# Altium project master-010106.PrjPcb (part 5 of 5)

## Sheet memorycard.SchDoc: foxBMS BMS-Extension
size A3; DocumentNumber: 10; SheetNumber: 10; SheetTotal: 14; Author: Fraunhofer IISB foxBMS Team; REL-DATE: 2017-05-16; VERSION: 1.0.2; GateName_1: G$1; SymbolName_1: FRAME_B_L; LibraryName: foxBMS_BMS-Master_V1.00_A; DeviceSetName: FRAME_B_L; GateName_2: G$2; SymbolName_2: DOCFIELD; SheetDescription: Memorycard
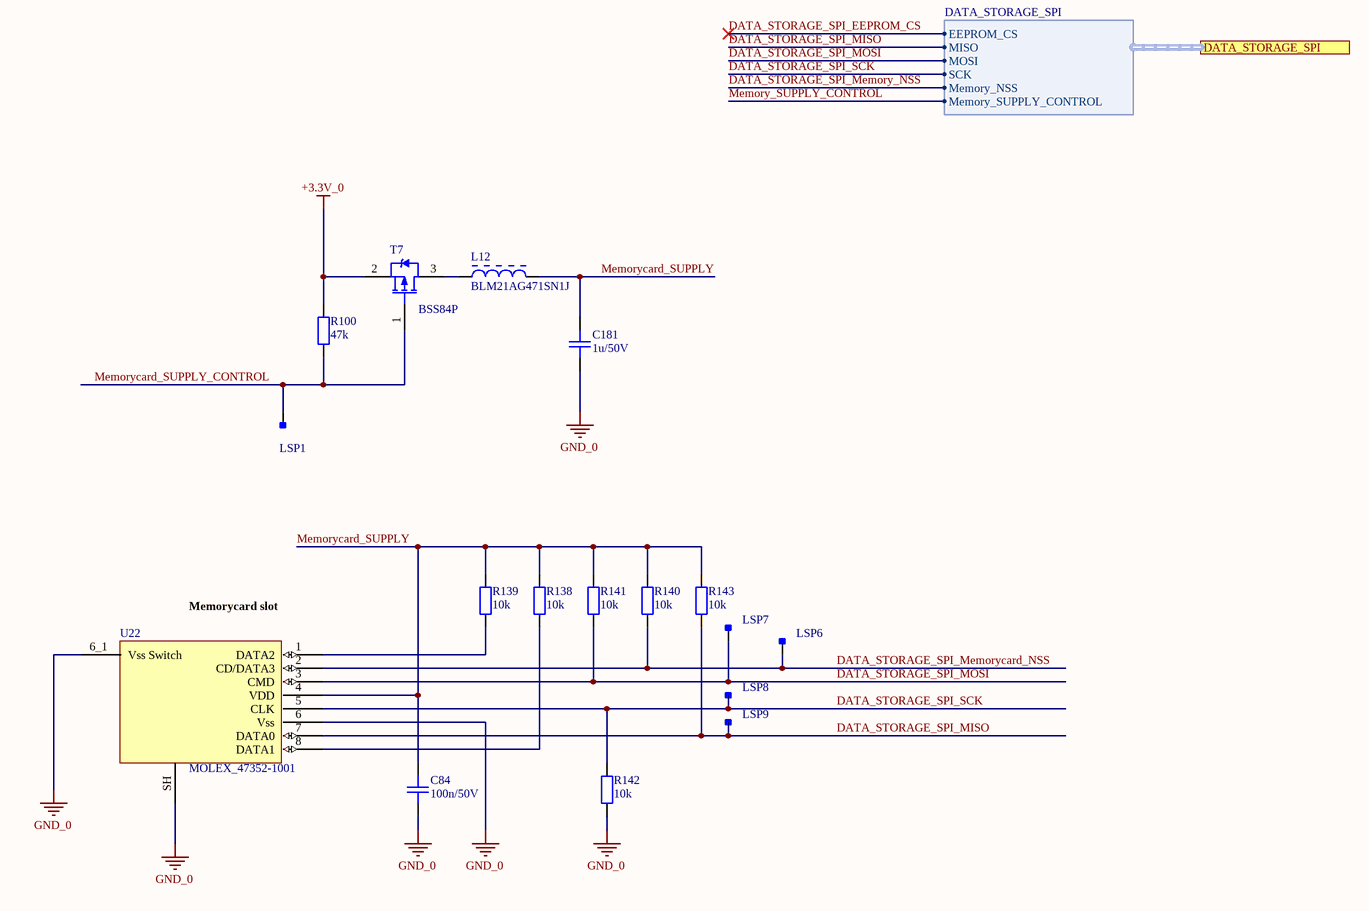
[diagram p25: memorycard.SchDoc]

### Parts
(Parts that share a designator on the sheet are numbered #1, #2 ... from top to bottom, then left to right.)
C84#2  100n/50V  [0603C]
C181  1u/50V  [0603C]
L12  BLM21AG471SN1J  [MURA-BLM21-H1-CHIP-2_V]
LSP1  Testpoint_Square  [Testpoint_S1]  (value not drawn)  (no BOM)
LSP6  Testpoint_Square  [Testpoint_S1]  (value not drawn)  (no BOM)
LSP7  Testpoint_Square  [Testpoint_S1]  (value not drawn)  (no BOM)
LSP8  Testpoint_Square  [Testpoint_S1]  (value not drawn)  (no BOM)
LSP9  Testpoint_Square  [Testpoint_S1]  (value not drawn)  (no BOM)
R100#2  47k  [0603R]
R138  10k  [0603R]
R139  10k  [0603R]
R140  10k  [0603R]
R141  10k  [0603R]
R142  10k  [0603R]
R143  10k  [0603R]
T7#2  BSS84P  [INF-PG-SOT23_N]
U22  MOLEX_47352-1001  [MOLEX_47352_1001]

### Ports
DATA_STORAGE_SPI (harness DATA_STORAGE_SPI)

### Harnesses
DATA_STORAGE_SPI: EEPROM_CS, MISO, MOSI, SCK, Memory_NSS, Memory_SUPPLY_CONTROL

### Nets
+3.3V_0: R100#2.2 T7#2.2(SOURCE)
GND_0: C84#2.1 C181.2 R142.1 U22.6(Vss) U22.6_1(Vss_Switch) U22.SH  [project net GND]
DATA_STORAGE_SPI_Memorycard_NSS: LSP6.1 R140.1 U22.2(CD/DATA3)
DATA_STORAGE_SPI_MISO: LSP9.1 R143.1 U22.7(DATA0) ; port DATA_STORAGE_SPI.MISO
DATA_STORAGE_SPI_MOSI: LSP7.1 R141.1 U22.3(CMD) ; port DATA_STORAGE_SPI.MOSI
DATA_STORAGE_SPI_SCK: LSP8.1 R142.2 U22.5(CLK) ; port DATA_STORAGE_SPI.SCK
Memorycard_SUPPLY: C84#2.2 C181.1 L12.1 R138.2 R139.2 R140.2 R141.2 R143.2 U22.4(VDD)
Memorycard_SUPPLY_CONTROL: LSP1.1 R100#2.1 T7#2.1(GATE)
NetL12_2: L12.2 T7#2.3(DRAIN)
NetR138_1: R138.1 U22.8(DATA1)
NetR139_1: R139.1 U22.1(DATA2)

### Notes on the sheet
- (near U22) Memorycard slot
- Fraunhofer IISB
- Schottkystr. 10
- developed by:
- 91058 Erlangen
- Germany
- Author
- Project
- License
- Description
- File
- Version
- Release Date
- Sheet
- www.foxbms.org
- www.iisb.fraunhofer.de
- foxBMS Team
- /

### Library data of the parts
C84#2 = gen_C_ceramic_100n_50V_X7R_0603: MLCC; Capacitance: 100n; Rated Voltage: 50V; Dielectric: X7R; Case EIA: 0603; Case Metric: 1608; PnP Package: C_0603_10; PnP Value: 100n/50V/X7R; PnP equipped: x; Part Number: gen_C_ceramic_100n_50V_X7R_0603; Supplier 1: Farnell; Supplier Part Number 1: 2525267
C181 = gen_C_ceramic_1u_50V_X7R_0603: MLCC; Capacitance: 1u; Rated Voltage: 50V; Dielectric: X7R; Tolerance: ± 10%; Case EIA: 0603; Case Metric: 1608; Part Number: gen_C_ceramic_1u_50V_X7R_0603; Operating Temperature: -55°C - +125°C; Supplier 1: Farnell; Supplier Part Number 1: 2779055
L12 = CMP-0686-00649-2: Chip Ferrite Bead for General Signal lines, 470 Ohm, 700 mA, -55 to 125 degC, 2 x 1.25 x 1.05 mm SMD, Tape and Reel; Manufacturer: Murata; DC Resistance: 0.19 Ohm Max.; Impedance (at 100 MHz): 470 Ohm +/- 25%; Rated Current: 700 mA; ComponentLink1URL: http://www.murata.com/; Packing: Tape and Reel; PackageDescription: 2-Pin Chip, Body 2 x 1.25 mm; ComponentLink3Description: Package Specification; Operating Temperature Range: -55 to 125 degC; ComponentLink1Description: Manufacturer URL; PartNumber: BLM21AG471SN1J; DatasheetVersion: 08/2013; Mounting Technology: Surface Mount; ComponentLink2URL: http://www.murata.com/products/catalog/pdf/c31e.pdf; ComponentLink3URL: http://www.murata.com/products/catalog/pdf/c31e.pdf; ComponentLink2Description: Datasheet; PackageReference: BLM21_H1050-2
LSP1 LSP6-LSP9 = Testpoint_Square: Testpoint, square; Part Number: Testpoint_Square
R100#2 = gen_R_47k_0603: SMD Resistor 47k 0603; Tolerance: 1%; Power: 0.1W; Case EIA: 0603; Case Metric: 1608; Maximum Working Voltage: 75V; PnP Package: R_0603; Part Number: gen_R_47k_0603; Operating Temperature: -55°C - +155°C; Resistance: 47k; Series: E24; PnP Value: 47k; Supplier 1: Farnell; Supplier Part Number 1: 2073510
R138-R143 = gen_R_10k_0603: SMD Resistor 10k 0603; Tolerance: 1%; Power: 0.1W; Case EIA: 0603; Case Metric: 1608; Maximum Working Voltage: 75V; PnP Package: R_0603; Part Number: gen_R_10k_0603; Operating Temperature: -55°C - +155°C; Resistance: 10k; Series: E24, E96; PnP Value: 10k; Supplier 1: Farnell; Supplier Part Number 1: 2073349
T7#2 = CMP-1099-00028-1: P-Channel SIPMOS Small-Signal-Transistor, -60 V VDS, -0.17 A ID, -55 to 150 degC, PG-SOT23, Reel, Green; Manufacturer: Infineon; VGS(th) (max): -2Â V; VGS(th) (min): -1Â V; VDS (max): -60Â V; Rth: 350Â K/W; Pto t (max): 0.36Â W; ID (max): -0.17Â A; IDpuls (max): -0.68Â A; RDS (on) (max) (@4.5V): 12,000Â mOhm; QG: 1Â nC; Green: TRUE; RDS (on) (max): 8,000Â mOhm; ComponentLink3URL: http://www.infineon.com/dgdl/SOT23-Package_Overview.pdf?folderId=db3a30431936bc4b0119532290053c66&fileId=db3a30431936bc4b0119533468123c85; ComponentLink3Description: Package Specification; Packing: Reel; PartNumber: BSS84P; ComponentLink2Description: Datasheet; Mounting Technology: Surface Mount; ComponentLink2URL: http://www.infineon.com/dgdl/BSS84P_Rev2.7%5B1%5D.pdf?folderId=db3a304314dca38901154a72e3951a65&fileId=db3a304330f68606013118ac7a9b4549; PackageReference: PG-SOT23; ComponentLink1URL: http://www.infineon.com/; PackageVersion: Apr-08; ComponentLink1Description: Manufacturer URL; PackageDescription: 3-Pin Small Outline Transistor Package, 2.9 x 1.3 mm Body, 0.95 mm Pitch; Halogen-free: TRUE; DatasheetVersion: Rev. 2.7
U22 = molex_47352-1001: 1.10mm Pitch Memorycard Card Connector, Push-Push Type, with VSS (Supply Voltage Ground) Detect Switch, Lead-Free; Manufacturer: Molex; Circuits: 10; Rated Voltage: 100V DC; Rated Current: 0.5A; Automotive Qualified: False; Part Number: molex_47352-1001; Part Name: 47352-1001; Operating Temperature: -20°C - +85°C; ComponentLink1Description: Drawing; ComponentLink1URL: http://www.molex.com/pdm_docs/sd/473521001_sd.pdf; Supplier 1: Farnell; Supplier Part Number 1: 2424133

## Sheet CAN_new.SchDoc: foxBMS BMS-Master
size A3; DocumentNumber: 14; SheetNumber: 14; SheetTotal: 24; Author: Fraunhofer IISB foxBMS Team; REL-DATE: 2017-05-16; VERSION: 1.0.6; SheetDescription: CAN0 Interface for MCU0; Rule: UNIONINDEX=0|RULEKIND=Clearance|NETSCOPE=DifferentNets|LAYERKIND=SameLayer|NAME=Schematic Clearance Constraint|GAP=10mil|GENERICCLEARANCE=10mil|IGNOREPADTOPADCLEARANCEINFOOTPRINT=FALSE|OBJECTCLEARANCES=ClearanceObj_Arc-ClearanceObj_Hole:0;ClearanceObj_Track-ClearanceObj_Hole:0;ClearanceObj_SMDPad-ClearanceObj_Hole:0;ClearanceObj_THPad-ClearanceObj_Hole:0;ClearanceObj_Via-ClearanceObj_Hole:0;ClearanceObj_Fill-ClearanceObj_Hole:0;ClearanceObj_Poly-ClearanceObj_Hole:0;ClearanceObj_Region-ClearanceObj_Hole:0;ClearanceObj_Text-ClearanceObj_Hole:0|UNIT=Metric
Used 2 times, as channels U_08_CAN1, U_08_CAN0. Parts and nets are listed once, with the designators drawn on the sheet.
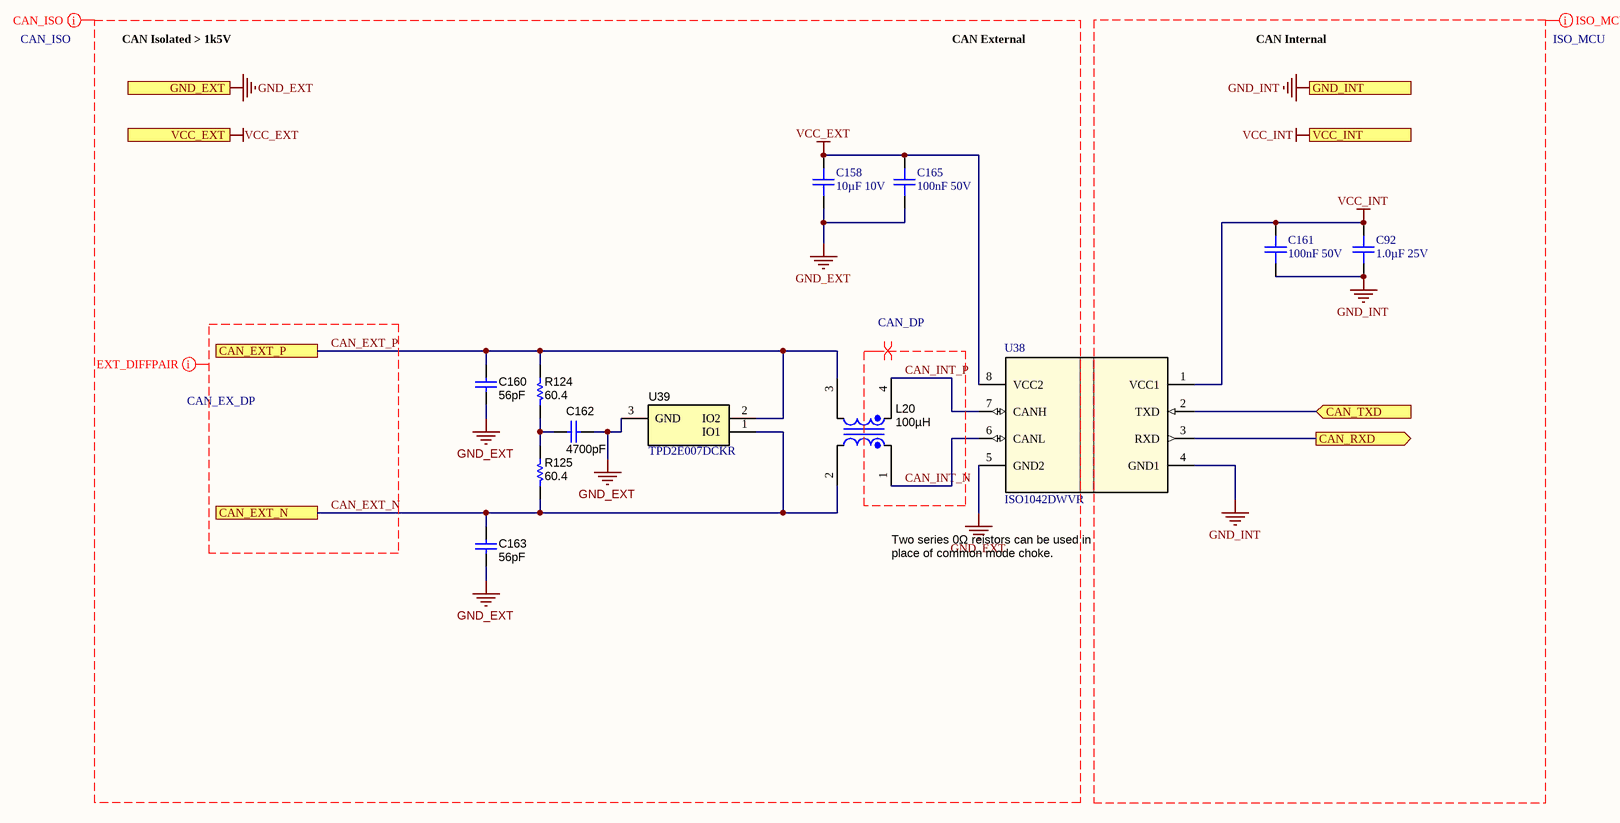
[diagram p26: CAN_new.SchDoc]

### Parts
C92  1.0µF 25V  [0603C]
C158  10µF 10V  [0805C]
C160  ValueDisplayed: 56pF  [0603C]  (hidden comment: GRM1885C1H560JA01D)
C161  100nF 50V  [0603C]
C162  ValueDisplayed: 4700pF  [0603C]  (hidden comment: GCM188R71H472KA37D)
C163  ValueDisplayed: 56pF  [0603C]  (hidden comment: GRM1885C1H560JA01D)
C165  100nF 50V  [0603C]
L20  ValueDisplayed: 100µH  [SIMDAD_1812]  (hidden comment: B82789C0104H001)
R124  ValueDisplayed: 60.4  [1206R]  (hidden comment: CRCW120660R4FKEA)
R125  ValueDisplayed: 60.4  [1206R]  (hidden comment: CRCW120660R4FKEA)
U38  ISO1042DWVR  [DWV0008A]
U39  TPD2E007DCKR  [DCK0003A_N]

### Ports
CAN_EXT_N, CAN_EXT_P, CAN_RXD (out), CAN_TXD (in), GND_EXT, GND_INT, VCC_EXT, VCC_INT

### Nets
GND_EXT: C158.2 C160.2 C162.2 C163.2 C165.1 U38.5(GND2) U39.3(GND) ; port GND_EXT
GND_INT: C92.1 C161.1 U38.4(GND1) ; port GND_INT
VCC_EXT: C158.1 C165.2 U38.8(VCC2) ; port VCC_EXT
VCC_INT: C92.2 C161.2 U38.1(VCC1) ; port VCC_INT
CAN_EXT_N: C163.1 L20.2 R125.1 U39.1(IO1) ; port CAN_EXT_N
CAN_EXT_P: C160.1 L20.3 R124.2 U39.2(IO2) ; port CAN_EXT_P
CAN_INT_N: L20.1 U38.6(CANL)
CAN_INT_P: L20.4 U38.7(CANH)
CAN_RXD: U38.3(RXD) ; port CAN_RXD
CAN_TXD: U38.2(TXD) ; port CAN_TXD
NetC162_1: C162.1 R124.1 R125.2

### Channels
U_08_CAN1: designators end in _1; ports CAN_EXT_N=CAN_EXT_N_U_08_CAN1 CAN_EXT_P=CAN_EXT_P_U_08_CAN1 CAN_RXD=CAN_1_RX CAN_TXD=CAN_1_TX GND_EXT=GND GND_INT=GND VCC_EXT=+3.3V_COM VCC_INT=+3.3V_0
U_08_CAN0: designators end in _2; ports CAN_EXT_N=CAN_EXT_N_U_08_CAN0 CAN_EXT_P=CAN_EXT_P_U_08_CAN0 CAN_RXD=CAN_0_RX CAN_TXD=CAN_0_TX GND_EXT=GND GND_INT=GND VCC_EXT=+3.3V_COM VCC_INT=+3.3V_0

### Layout directives
net class CAN_ISO: CAN_EXT_N, CAN_EXT_P, CAN_INT_N, CAN_INT_P, GND_EXT, VCC_EXT
net class ISO_MCU: GND_INT, VCC_INT
differential pair; differential pair class CAN_DP: CAN_INT_N, CAN_INT_P
differential pair; differential pair class CAN_EX_DP: CAN_EXT_N, CAN_EXT_P

### Notes on the sheet
- CAN Isolated > 1k5V
- CAN External
- CAN Internal
- Two series 0Ω reistors can be used in
- place of common mode choke.
- Fraunhofer IISB
- Schottkystr. 10
- developed by:
- 91058 Erlangen
- Germany
- Author
- Project
- License
- Description
- File
- Version
- Release Date
- Sheet
- www.foxbms.org
- www.iisb.fraunhofer.de
- foxBMS Team
- /

### Library data of the parts
C92 = gen_C_ceramic_1u_25V_X7R_0603: Ceramic, 1.0µF, ±10%, 25V, X7R, –55 to 125°C, 0603 (1608),RoHS, Automotive; Part Number: GCJ188R71E105KA01; Manufacturer: Murata; Capacitance: 1µF; Case EIA: 0603; Case Metric: 1608; PnP Package: C_0603_10; PnP Value: 1.0µF/25V/X7R; Automotive Qualified: True; Rated Voltage: 25V; Dielectric: X7R; Supplier 1: Digi-Key; Supplier Part Number 1: 490-14409-1-ND; Height - Seated (Max): 0.8mm; Mounting Type: SurfaceMount,MLCC; Operating Temperature: –55 to 125°C; Series: GCJ; Tolerance: ±10%; Manufacturer_Part_Number: GCJ188R71E105KA01
C158 = gen_C_ceramic_10u_10V_X7R_0805: Ceramic, 10µF, ±10%, 10V, X7R, –55 to 125°C, 0805 (2012),RoHS, Automotive; Part Number: GCJ21BR71A106KE01; Manufacturer: Murata; Case EIA: 0805; Case Metric: 2012; Automotive Qualified: True; PnP Package: C_0805_10; PnP Value: 10µF/10V/X7R; Capacitance: 10µF; Rated Voltage: 10V; Dielectric: X7R; Supplier 1: Digi-Key; Supplier Part Number 1: 490-12646-1-ND; Height - Seated (Max): 1.25mm; Mounting Type: SurfaceMount,MLCC; Operating Temperature: –55 to 125°C; Series: GCJ; Tolerance: ±10%; Manufacturer_Part_Number: GCJ21BR71A106KE01
C160 C163 = GRM1885C1H560JA01D: CAP, CERM, 56 pF, 50 V, +/- 5%, C0G/NP0, 0603; Manufacturer: MuRata; Polarized: N; CompType: Capacitor; Value: 56pF; U/M: EA; Cap_F: 0.000000000056; Tolerance_%: 5; Value1: Unknown; VDC_V: 50; Value2: 50V; TaMin_C: -55; TaMax_C: 125; Cap_Case: 0603; SizeArea_mm2: 1.28; SizeAreaWB_mm2: 4.68; SizeX_mm: 1.6; SizeY_mm: 0.8; SizeZ_mm: 1; AEC Category: Q200; SymbolVersion: 2008-07-09; PartNumber: GRM1885C1H560JA01D; PackageReference: 0603; RoHS: Y; MountType: SMT; Technology: Ceramic; TempCo: C0G/NP0; Published: 2008-06-19; Publisher: Texas Instruments; LatestRevisionDate: 2017-03-07; ComponentLink1Description: Datasheet link; ComponentLink1URL: http://search.murata.co.jp/Ceramy/PnsearchViewAction.do?HnOFG=ON&HnNFG=ON&SEL_CNT=50&sLang=en&sKey=GRM1885C1H560JA01D&x=9&y=9&search=startwith; Supplier 1: Digi-Key; Supplier Part Number 1: 490-1421-1-ND; Supplier 2: Mouser; Supplier Part Number 2: 81-GRM39C560J50; Supplier 3: Farnell; Supplier Part Number 3: 1828911; AEC Qualified: ?
C161 C165 = gen_C_ceramic_100n_50V_X7R_0603: Ceramic, 100nF, ±10%, 50V, X7R, –55 to 125°C, 0603 (1608),RoHS, Automotive; Part Number: GCJ188R71H104KA12; Manufacturer: Murata; Capacitance: 100n; Case EIA: 0603; Case Metric: 1608; PnP Package: C_0603_10; PnP Value: 100nF/50V/X7R; PnP equipped: x; Automotive Qualified: True; Rated Voltage: 50V; Dielectric: X7R; Supplier 1: Digi-Key; Supplier Part Number 1: 490-5798-1-ND; Height - Seated (Max): 0.8mm; Mounting Type: SurfaceMount,MLCC; Operating Temperature: –55 to 125°C; Series: GCJ; Tolerance: ±10%; Manufacturer_Part_Number: GCJ188R71H104KA12
C162 = GCM188R71H472KA37D: CAP, CERM, 4700 pF, 50 V, +/- 10%, X7R, AEC-Q200 Grade 1, 0603; Manufacturer: MuRata; Polarized: N; CompType: Capacitor; Value: 4700pF; U/M: EA; Cap_F: 0.0000000047; Tolerance_%: 10; Value1: Unknown; VDC_V: 50; Value2: 50V; TaMin_C: -55; TaMax_C: 125; Cap_Case: 0603; SizeArea_mm2: 1.28; SizeAreaWB_mm2: 4.68; SizeX_mm: 1.6; SizeY_mm: 0.8; SizeZ_mm: 1; AEC Category: Q200; AEC Qualified: Y; SymbolVersion: 2008-07-09; PartNumber: GCM188R71H472KA37D; PackageReference: 0603; RoHS: Y; MountType: SMT; Technology: Ceramic; TempCo: X7R; Published: 2008-06-19; Publisher: Texas Instruments; LatestRevisionDate: 2017-03-07; ComponentLink1Description: Datasheet link; ComponentLink1URL: http://psearch.murata.com/capacitor/product/GCM188R71H472KA37%23.pdf; Supplier 1: Digi-Key; Supplier Part Number 1: 490-4932-1-ND; Supplier 2: Mouser; Supplier Part Number 2: 81-GCM188R71H472K37D; AEC Grade: 1
L20 = B82789C0104H001: Coupled inductor, 100 µH, 0.15 A, 1.5 ohm, SMD; Manufacturer: TDK; SymbolCreator: a0412235; Value: 100uH; Ind_H: 100.0E-6; DCR_ohm: 1.5; SymbolVersion: 2013-02-26; PartNumber: B82789C0104H001; PackageReference: 4.5x3.0x3.2mm; MountType: SMT; ComponentLink1URL: http://www.epcos.com/inf/30/db/ind_2008/b82789c0_s0.pdf; ComponentLink1Description: Datasheet URL; RoHS: Y; CompType: Coupled Inductor; Publisher: Texas Instruments; Published: 2008-05-16; LatestRevisionDate: 2017-02-16; Supplier 1: Mouser; Supplier Part Number 1: 871-B82789C0104H001
R124 R125 = CRCW120660R4FKEA: RES, 60.4, 1%, 0.25 W, 1206; Manufacturer: Vishay-Dale; CompType: Resistor; Value: 60.4; Value_Code: 60R4; Tolerance_%: 1; Power_W: 0.25; Value2: 0.25W; VDC_V: 200; TempCo: 100 ppm/C; SizeArea_mm2: 5.12; SizeX_mm: 3.2; SizeY_mm: 1.6; SizeZ_mm: 1.35; EIA_Code: E96; U/M: EA; AEC Category: Q200; SymbolVersion: 2009-05-29; PartNumber: CRCW120660R4FKEA; PackageReference: 1206; RoHS: Y; Res_ohm: 60.4; Value1: 1%; MountType: SMT; Technology: Thick Film; Published: 2008-06-26; Publisher: Texas Instruments; LatestRevisionDate: 2017-03-07; ComponentLink1Description: Datasheet link; ComponentLink1URL: http://www.vishay.com/docs/20035/dcrcwe3.pdf; Supplier 1: Digi-Key; Supplier Part Number 1: 541-60.4FCT-ND; Supplier 2: Newark; Supplier Part Number 2: 53K2546; Supplier 3: Mouser; Supplier Part Number 3: 71-CRCW1206-60.4-E3; AEC Qualified: ?
U38 = ISO1042DWVR: Imported; Manufacturer: Texas Instruments; PartNumber: ISO1042DWVR; RefDes: RefDes; TYPE: TYPE; Value: Value
U39 = TPD2E007DCKR: ESD Protection Array for AC Signal Data Interface, 2 Channels, -40 to +85 degC, 3-pin SC70 (DCK), Green (RoHS & no Sb/Br); Manufacturer: Texas Instruments; Alternate PartNumber: Equivalent; Breakdown Voltage(Min)(V): +/-14; IEC 61000-4-2 Air-Gap(+/- kV): 15; IEC 61000-4-2 Contact(+/- kV): 8; IO Leakage Current(nA): 50; SubFamily: ESD Solution; DatasheetVersion: SLVS796E; PackageVersion: revG, Jan-2007; PackageReference: DCK0003A; PackageDescription: 3-Pin Plastic Small-Outline Package, 0.65 mm Pitch, 2.1 mm Lead Span; Supplier 1: Digi-Key; Supplier Part Number 1: 296-25281-2-ND; Supplier 2: Digi-Key; Supplier Part Number 2: 296-25281-1-ND; Supplier 3: Digi-Key; Supplier Part Number 3: 296-25281-6-ND; Supplier 4: Farnell; Supplier Part Number 4: 2120465; Supplier 5: Newark; Supplier Part Number 5: 94T5089; Supplier 6: Newark; Supplier Part Number 6: 55R7554; Supplier 7: Mouser; Supplier Part Number 7: 595-TPD2E007DCKR; Eco-Plan: Green (RoHS & no Sb/Br); IO Capacitance(Typ)(pF): 15; MountType: SMT; PartNumber: TPD2E007DCKR; ComponentLink1Description: Datasheet; ComponentLink1URL: http://www.ti.com/general/docs/lit/getliterature.tsp?genericPartNumber=TPD2E007&fileType=pdf; ComponentLink2Description: URL Link1; ComponentLink2URL: SamplesURL:http://www.ti.com/product/tpd2e007#samples; Alternate Manufacturer: Texas Instruments

## Sheet isolated_usb_single.SchDoc
size A4 portrait
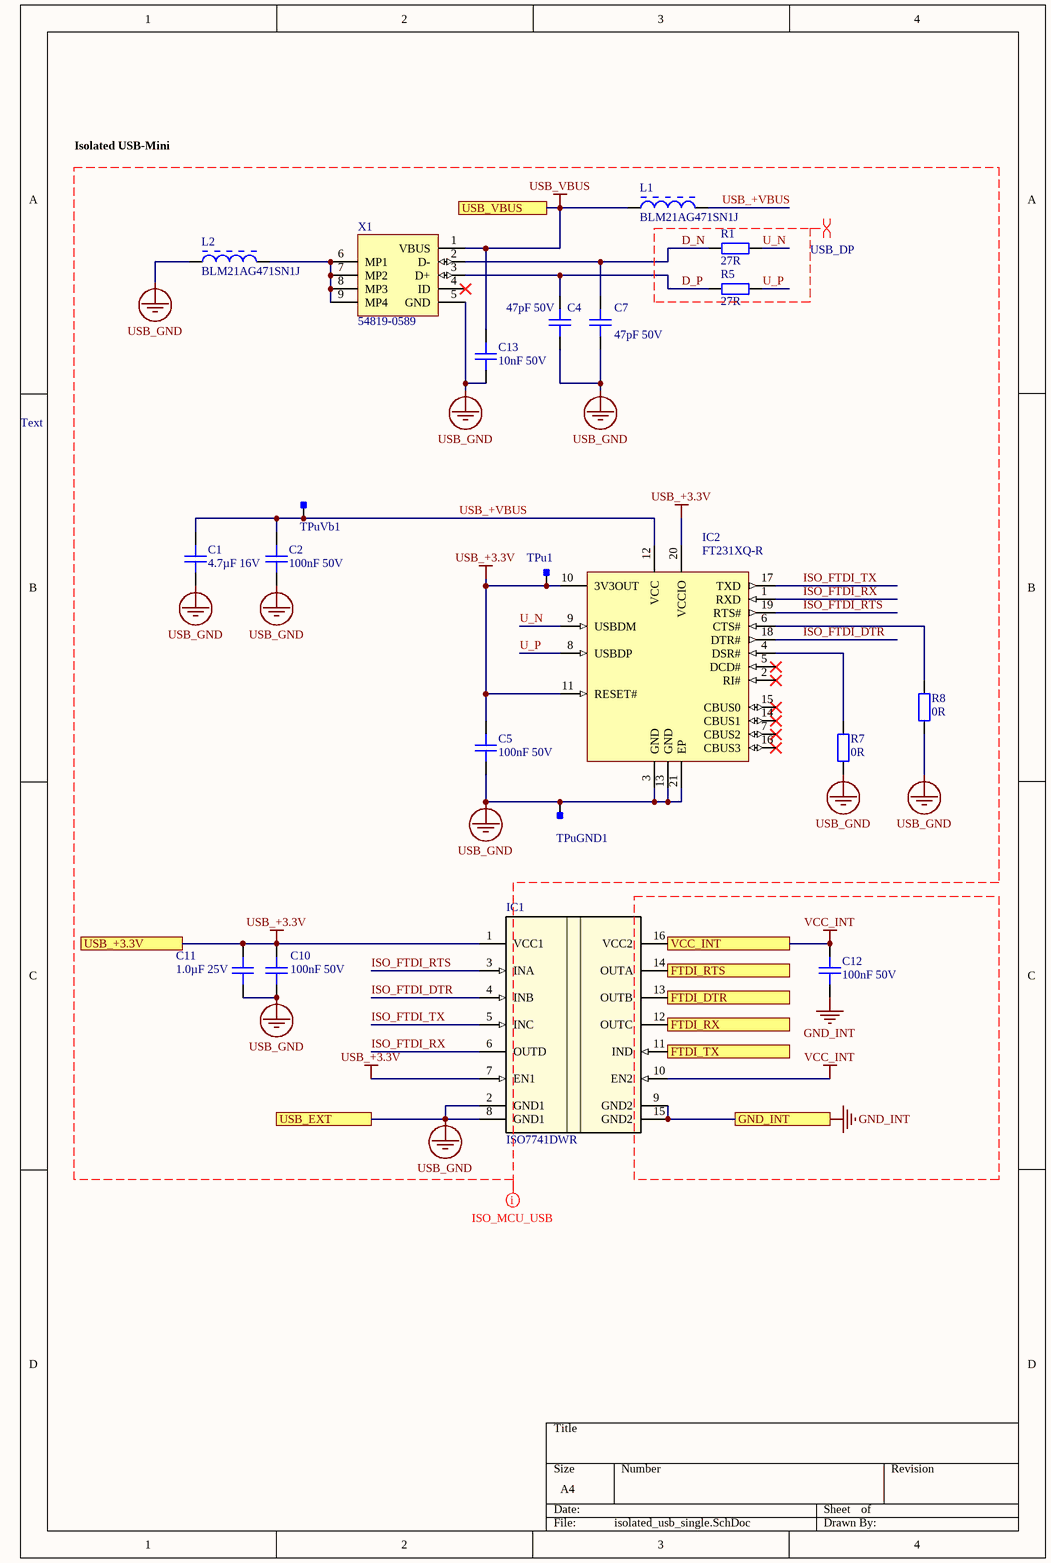
[diagram p27: isolated_usb_single.SchDoc]

### Parts
(Parts that share a designator on the sheet are numbered #1, #2 ... from top to bottom, then left to right.)
C1  4.7µF 16V  [0805C]
C2#2  100nF 50V  [0603C]
C4  47pF 50V  [0402C]
C5  100nF 50V  [0603C]
C7  47pF 50V  [0402C]
C10  100nF 50V  [0603C]
C11#2  1.0µF 25V  [0603C]
C12#2  100nF 50V  [0603C]
C13  10nF 50V  [0603C]
IC1  ISO7741DWR  [DW0016B_N]
IC2  FT231XQ-R  [QFN-20_N]
L1  BLM21AG471SN1J  [MURA-BLM21-H1-CHIP-2_V]
L2  BLM21AG471SN1J  [MURA-BLM21-H1-CHIP-2_V]
R1#2  27R  [0603R]
R5#2  27R  [0603R]
R7  0R  [0603R]
R8  0R  [0603R]
TPu1  Testpoint_Square  [Testpoint_S1]  (value not drawn)  (no BOM)
TPuGND1  Testpoint_Square  [Testpoint_S1]  (value not drawn)  (no BOM)
TPuVb1  Testpoint_Square  [Testpoint_S1]  (value not drawn)  (no BOM)
X1  54819-0589  [54819-0589]

### Ports
FTDI_DTR (out), FTDI_RTS (out), FTDI_RX (out), FTDI_TX (in), GND_INT, USB_+3.3V, USB_EXT, USB_VBUS, VCC_INT

### Nets
GND_INT: C12#2.2 IC1.9(GND2) IC1.15(GND2) ; port GND_INT  [project net GND]
USB_+3.3V: C5.1 C10.1 C11#2.2 IC1.1(VCC1) IC1.7(EN1) IC2.10(3V3OUT) IC2.11(RESET#) IC2.20(VCCIO) TPu1.1 ; port USB_+3.3V
USB_GND: C1.2 C2#2.2 C4.1 C5.2 C7.1 C10.2 C11#2.1 C13.2 IC1.2(GND1) IC1.8(GND1) IC2.3(GND) IC2.13(GND) IC2.21(EP) L2.1 R7.2 R8.2 TPuGND1.1 X1.5(GND) ; port USB_EXT
USB_VBUS: C13.1 L1.1 X1.1(VBUS) ; port USB_VBUS
VCC_INT: C12#2.1 IC1.10(EN2) IC1.16(VCC2) ; port VCC_INT  [project net +3.3V_0]
D_N: C7.2 R1#2.1 X1.2(D-)
D_P: C4.2 R5#2.1 X1.3(D+)
ISO_FTDI_DTR: IC1.4(INB) IC2.18(DTR#)
ISO_FTDI_RTS: IC1.3(INA) IC2.19(RTS#)
ISO_FTDI_RX: IC1.6(OUTD) IC2.1(RXD)
ISO_FTDI_TX: IC1.5(INC) IC2.17(TXD)
U_N: IC2.9(USBDM) R1#2.2
U_P: IC2.8(USBDP) R5#2.2
USB_+VBUS: C1.1 C2#2.1 IC2.12(VCC) L1.2 TPuVb1.1
NetIC1_11: IC1.11(IND) ; port FTDI_TX
NetIC1_12: IC1.12(OUTC) ; port FTDI_RX
NetIC1_13: IC1.13(OUTB) ; port FTDI_DTR
NetIC1_14: IC1.14(OUTA) ; port FTDI_RTS
NetIC2_4: IC2.4(DSR#) R7.1
NetIC2_6: IC2.6(CTS#) R8.1
NetL2_2: L2.2 X1.6(MP1) X1.7(MP2) X1.8(MP3) X1.9(MP4)

Not connected (* = marked no-connect by the designer): IC2 2(RI#)* 5(DCD#)* 7(CBUS2)* 14(CBUS1)* 15(CBUS0)* 16(CBUS3)*; X1 4(ID)*

### Layout directives
net class ISO_MCU_USB: D_N, D_P, ISO_FTDI_DTR, ISO_FTDI_RTS, ISO_FTDI_RX, ISO_FTDI_TX, U_N, U_P, USB_+3.3V, USB_+VBUS, USB_GND, USB_VBUS
differential pair; differential pair class USB_DP: D_N, D_P, U_N, U_P

### Notes on the sheet
- Isolated USB-Mini
- Text

### Library data of the parts
C1 = gen_C_ceramic_4u7_16V_X7R_0805: Ceramic, 4.7µF, ±10%, 16V, X7R, –55 to 125°C, 0805 (2012),RoHS, Automotive; Part Number: GCJ21BR71C475KA01; Manufacturer: Murata; Capacitance: 4u7; Case EIA: 0805; Case Metric: 2012; AVT Set: x; Automotive Qualified: True; PnP Package: C_0805_10; PnP Value: 4.7µF/16V/X7R; Rated Voltage: 16V; Dielectric: X7R; Supplier 1: Digi-Key; Supplier Part Number 1: 490-10557-1-ND; Height - Seated (Max): 1.25mm; Mounting Type: SurfaceMount,MLCC; Operating Temperature: –55 to 125°C; Series: GCJ; Tolerance: ±10%; Manufacturer_Part_Number: GCJ21BR71C475KA01
C2#2 C5 C10 C12#2 = gen_C_ceramic_100n_50V_X7R_0603: as C161 on sheet CAN_new; Rated Voltage: 50V; Dielectric: X7R; Supplier 1: Digi-Key; Supplier Part Number 1: 490-5798-1-ND; Height - Seated (Max): 0.8mm; Mounting Type: SurfaceMount,MLCC; Operating Temperature: –55 to 125°C; Series: GCJ; Tolerance: ±10%; Manufacturer_Part_Number: GCJ188R71H104KA12
C4 C7 = gen_C_ceramic_47p_50V_C0G_0402: Ceramic, 47pF, ±5%, 50V, C0G, 25 to 125°C, 0402 (1005),RoHS, Automotive; Part Number: GCM1555C1H470JA16#; Manufacturer: Murata; Capacitance: 47; Case EIA: 0402; Case Metric: 1005; Automotive Qualified: True; PnP Package: C_0402_10; PnP Value: 47pF/50V/X7R; Rated Voltage: 50V; Dielectric: C0G; Supplier 1: Digi-Key; Supplier Part Number 1: 490-10670-1-ND; Height - Seated (Max): 0.5mm; Mounting Type: SurfaceMount,MLCC; Operating Temperature: -55 to 125°C; Series: GCM; Tolerance: ±5%; Manufacturer_Part_Number: GCM1555C1H470JA16#
C11#2 = gen_C_ceramic_1u_25V_X7R_0603: Ceramic, 1.0µF, ±10%, 25V, X7R, –55 to 125°C, 0603 (1608),RoHS, Automotive; Part Number: GCJ188R71E105KA01; Manufacturer: Murata; Case EIA: 0603; Case Metric: 1608; Capacitance: 1µF; Automotive Qualified: True; PnP Package: C_0603_10; PnP Value: 1.0µF/25V/X7R; Dielectric: X7R; Rated Voltage: 25V; Height - Seated (Max): 0.8mm; Mounting Type: SurfaceMount,MLCC; Operating Temperature: –55 to 125°C; Series: GCJ; Tolerance: ±10%; Manufacturer_Part_Number: GCJ188R71E105KA01; Supplier 1: Digi-Key; Supplier Part Number 1: 490-14409-1-ND
C13 = gen_C_ceramic_10n_50V_X7R_0603: Ceramic, 10nF, ±10%, 50V, X7R, –55 to 125°C, 0603 (1608),RoHS, Automotive; Part Number: GCJ188R71H102KA01; Manufacturer: Murata; Capacitance: 10n; Case EIA: 0603; Case Metric: 1608; PnP Package: C_0603_10; PnP Value: 10nF/50V/X7R; Automotive Qualified: True; Rated Voltage: 50V; Dielectric: X7R; Supplier 1: Digi-Key; Supplier Part Number 1: 490-5768-1-ND; Height - Seated (Max): 0.8mm; Mounting Type: SurfaceMount,MLCC; Operating Temperature: –55 to 125°C; Series: GCJ; Tolerance: ±10%; Manufacturer_Part_Number: GCJ188R71H102KA01
IC1 = ISO7741DWR: Imported; Manufacturer: Texas Instruments; PartNumber: ISO7741DWR; RefDes: RefDes; TYPE: TYPE; Value: Value; Part Number: ISO7741DWR
IC2 = CMP-0248-00001-2: USB to Full-Handshake UART Interface Chip, UHCI/OHCI/EHCI Compatible, USB 2.0 Compatible, -40 to +85 degC, 20-Pin QFN, Pb-Free, Tape and Reel; Manufacturer: FTDI; PartNumber: FT231XQ-R; ComponentLink3Description: FT231X Product Page; Code_JEDEC: MO-220WGGD-1; DatasheetVersion: ver 1.2, Feb-2013; ComponentLink1URL: http://www.ftdichip.com/; PackageDescription: 20-Pin Quad Flat No-Lead, 4 x 4 mm Body, 0.5 mm Pitch; ComponentLink2URL: http://www.ftdichip.com/Support/Documents/DataSheets/ICs/DS_FT231X.pdf; ComponentLink3URL: www.ftdichip.com/Products/ICs/FT231X.html; PackageVersion: Feb-13; PackageReference: QFN-20; RevisionNote: DatasheetVersion updated to 1.2 Feb-2013; ComponentLink2Description: Datasheet; ComponentLink1Description: Manufacturer URL
L1 L2 = C5133952-28DE-41F1-874F-4A9C3E40D898: Chip Ferrite Bead for General Signal lines, 470 Ohm, 700 mA, -55 to 125 degC, 2 x 1.25 x 1.05 mm SMD, Tape and Reel; Manufacturer: Murata; DC Resistance: 0.19 Ohm Max.; Impedance (at 100 MHz): 470 Ohm +/- 25%; Rated Current: 700 mA; ComponentLink1URL: http://www.murata.com/; Packing: Tape and Reel; PackageDescription: 2-Pin Chip, Body 2 x 1.25 mm; ComponentLink3Description: Package Specification; Operating Temperature Range: -55 to 125 degC; ComponentLink1Description: Manufacturer URL; PartNumber: BLM21AG471SN1J; DatasheetVersion: 08/2013; Mounting Technology: Surface Mount; ComponentLink2URL: http://www.murata.com/products/catalog/pdf/c31e.pdf; ComponentLink3URL: http://www.murata.com/products/catalog/pdf/c31e.pdf; ComponentLink2Description: Datasheet; PackageReference: BLM21_H1050-2; Part Number: BLM21AG471SN1J
R1#2 R5#2 = gen_R_27R_0603: SMD Resistor 27R 0603; Tolerance: 1%; Power: 0.1W; Case EIA: 0603; Case Metric: 1608; Maximum Working Voltage: 75V; PnP Package: R_0603; Automotive Qualified: False; Part Number: gen_R_27R_0603; Operating Temperature: -55°C - +155°C; Resistance: 27R; Series: E24; PnP Value: 27R; Supplier 1: Farnell; Supplier Part Number 1: 2059559
R7 R8 = gen_R_0R_0603: SMD Resistor 0R 0603; Power: 0.1W; Case EIA: 0603; Case Metric: 1608; PnP Package: R_0603; Maximum Working Voltage: 75V; Automotive Qualified: False; Part Number: gen_R_0R_0603; Operating Temperature: -55°C - +155°C; Resistance: 0R; Series: Jumper; PnP Value: 0R; Supplier 1: Farnell; Supplier Part Number 1: 2073345
TPu1 TPuGND1 TPuVb1 = Testpoint_Square: Testpoint, square; Part Number: Testpoint_Square
X1 = MOLX-67503-1020: USB, MINI, SMD, RA KME04-USBMU03A01; Manufacturer: Molex; ComponentLink1URL: http://www.molex.com/; PartNumber: 54819-0589; Mounting Technology: Surface Mount; ComponentLink1Description: Manufacturer URL; Terminal Pitch: 0.8 mm; DatasheetVersion: Rev F, 06/2009; ComponentLink2Description: Datasheet; PackageDescription: Mini USB Connector, TH, Righer Angle; ComponentLink2URL: http://www.molex.com/pdm_docs/sd/675031020_sd.pdf; PackageReference: 54819-0589

## Nets that join several sheets
+3-4.5v_out: supply_internal (R123.2 TPc1.1), isolated_dcdc_3.3to3.3 (6 pins)
+3.3V_0: FPGA_SPI_interface (C83.2 SV2101.2), supply_internal (6 pins), mcu0_primary (7 pins), ext_bootload_activation (R41#1.2 T6#1.2 X402.1), power (42 pins), SDRAM (14 pins), mcu0_to_mcu1_isolated_SPI (C29.1 C37.2 IC4_1.1 IC4_1.16), mcu1_secondary (28 pins), connector_to_BMS_extension (JP1.2 JP1.4 JP2.2 JP2.4), interlock_circuit (U8.4 U11#2.1 U21.4 U24.1), contactor_control (6 pins), EEPROM (C78#2.2 IC3#2.8 R74.2 R80.2), U_15_bms-interface_interface/Primary LTC6820 (5 pins), U_15_bms-interface_interface/Primary LTC6820/U_0301_LTC6820_forward (5 pins), U_15_bms-interface_interface/Primary LTC6820/U_0301_LTC6820_reverse (5 pins), U_15_bms-interface_interface/Secondary LTC6820 (5 pins), U_15_bms-interface_interface/Secondary LTC6820/U_0301_LTC6820_forward (5 pins), U_15_bms-interface_interface/Secondary LTC6820/U_0301_LTC6820_reverse (5 pins), isolated_rs485 (C6.1 C1303.1 IC1303.1), memorycard (R100#2.2 T7#2.2), U_08_CAN1 (C92_1.2 C161_1.2 U38_1.1), U_08_CAN0 (C92_2.2 C161_2.2 U38_2.1), isolated_usb_single (C12#2.1 IC1.10 IC1.16)
+3.3V_0+: supply_internal (R116.2), U_03_supply1/MCU_0_VCC (5 pins)
+3.3V_1+: supply_internal (R6.2), U_03_supply1/MCU_1_VCC (5 pins)
+3.3V_COM: hierarchy (P1.5 P2.6 X801.3), supply_internal (7 pins), isolated_dcdc_3.3to3.3 (C120.2 L16.2 R108.2 U31.2), contactor_control (14 pins), isolated_rs485 (C2#1.1 C1302.1 IC1303.16), U_08_CAN1 (C158_1.1 C165_1.2 U38_1.8), U_08_CAN0 (C158_2.1 C165_2.2 U38_2.8)
+5.0V_0: FPGA_SPI_interface (C79.1 SV2101.1), supply_internal (R113.1), U_03_supply1/MCU_0_VCC (7 pins), mcu0_primary (LS1.1 R61.2), power (R65#2.2)
+5.0V_0+: supply_internal (R16.2 R113.2 TPi2.1 TPi3.1), U_03_supply1/MCU_0_ISO (6 pins), U_03_supply1/MCU_1_ISO (6 pins)
+5.0V_1: supply_internal (R16.1), U_03_supply1/MCU_1_VCC (7 pins)
+9-30V_IN: supply_internal (R51#1.2), U_03_supply1/MCU_0_ISO (C24_1.1 L1_1.1), U_03_supply1/MCU_1_ISO (C24_2.1 L1_2.1), dcdc_wide_3v3 (5 pins), supply_external (C65.2 TPeSUP1.1 U13.23 U13.24), interlock_circuit (SV3.3)
EXT_+3.3V_0+: supply_internal (R57.2 TPe1.1), dcdc_wide_3v3 (6 pins)
GND: hierarchy (P1.2 P2.1 X801.6), FPGA_SPI_interface (C79.2 C83.1 SV2101.5 SV2101.6), supply_internal (C107.1 R4#1.2 R62#1.1 U28.2), U_03_supply1/MCU_0_ISO (15 pins), U_03_supply1/MCU_1_ISO (15 pins), isolated_dcdc_3.3to3.3 (9 pins), U_03_supply1/MCU_0_VCC (10 pins), dcdc_wide_3v3 (13 pins), U_03_supply1/MCU_1_VCC (10 pins), supply_external (29 pins), mcu0_primary (19 pins), crystals (5 pins), debug_LED (R29.1 R30.1), ext_bootload_activation (R45.1), power (47 pins), SDRAM (14 pins), mcu0_to_mcu1_isolated_SPI (C29.2 C37.1 IC4_1.8 IC4_1.9), mcu1_secondary (39 pins), connector_to_BMS_extension (JP1.1 JP1.3 JP2.1 JP2.3), interlock_circuit (13 pins), contactor_control (39 pins), EEPROM (C78#2.1 IC3#2.4), U_15_bms-interface_interface/Primary LTC6820 (C23_1.1 U4_1.7 U4_1.15), U_15_bms-interface_interface/Primary LTC6820/U_0301_LTC6820_forward (9 pins), U_15_bms-interface_interface/Primary LTC6820/U_0301_LTC6820_reverse (9 pins), bms-slave-magnetics (C127.2 C128.1 C129.2 C130.1), U_15_bms-interface_interface/Secondary LTC6820 (C23_2.1 U4_2.7 U4_2.15), U_15_bms-interface_interface/Secondary LTC6820/U_0301_LTC6820_forward (9 pins), U_15_bms-interface_interface/Secondary LTC6820/U_0301_LTC6820_reverse (9 pins), isolated_rs485 (10 pins), memorycard (6 pins), U_08_CAN1 (10 pins), U_08_CAN0 (10 pins), isolated_usb_single (C12#2.2 IC1.9 IC1.15)
SUPPLY_ext: supply_external (6 pins), interlock_circuit (SV3.5 SV3.7 U18.7 U18.8), contactor_control (X1201.9 X1201.11 X1201.13 X1201.15)
ABEXT_N: hierarchy (P2.2), isolated_rs485 (R49#2.1 U1.2)
ABEXT_P: hierarchy (P2.5), isolated_rs485 (R54.1 U1.1)
ADC_MCU_0_CH_0: mcu0_primary (IC10.54), connector_to_BMS_extension (JP1.7)
ADC_MCU_0_CH_1: mcu0_primary (IC10.55), connector_to_BMS_extension (JP1.8)
ADC_MCU_0_CH_2: mcu0_primary (IC10.56), connector_to_BMS_extension (JP1.5)
ADC_MCU_0_CH_3: mcu0_primary (IC10.57), connector_to_BMS_extension (JP1.6)
ADC_MCU_0_CH_4: mcu0_primary (IC10.41), connector_to_BMS_extension (JP1.10)
BMS-INTERFACE_0_SPI_CS: mcu0_primary (IC10.50), U_15_bms-interface_interface/Primary LTC6820 (U4_1.4 U4_1.5)
BMS-INTERFACE_0_SPI_MISO: mcu0_primary (IC10.52), U_15_bms-interface_interface/Primary LTC6820 (R13_1.1), U_15_bms-interface_interface/Primary LTC6820/U_0301_LTC6820_forward (IC250_1.2), U_15_bms-interface_interface/Primary LTC6820/U_0301_LTC6820_reverse (IC250_2.2)
BMS-INTERFACE_0_SPI_MOSI: mcu0_primary (IC10.53), U_15_bms-interface_interface/Primary LTC6820 (R14_1.1), U_15_bms-interface_interface/Primary LTC6820/U_0301_LTC6820_forward (IC250_1.1), U_15_bms-interface_interface/Primary LTC6820/U_0301_LTC6820_reverse (IC250_2.1)
BMS-INTERFACE_0_SPI_SCK: mcu0_primary (IC10.51), U_15_bms-interface_interface/Primary LTC6820/U_0301_LTC6820_forward (IC250_1.3), U_15_bms-interface_interface/Primary LTC6820/U_0301_LTC6820_reverse (IC250_2.3)
BMS-INTERFACE_1_GPIO_3: mcu1_secondary (IC1_1.90), U_15_bms-interface_interface/Secondary LTC6820 (R20_2.1)
BMS-INTERFACE_1_SPI_CS: mcu1_secondary (IC1_1.29), U_15_bms-interface_interface/Secondary LTC6820 (U4_2.4 U4_2.5)
BMS-INTERFACE_1_SPI_MISO: mcu1_secondary (IC1_1.31), U_15_bms-interface_interface/Secondary LTC6820 (R13_2.1), U_15_bms-interface_interface/Secondary LTC6820/U_0301_LTC6820_forward (IC250_3.2), U_15_bms-interface_interface/Secondary LTC6820/U_0301_LTC6820_reverse (IC250_4.2)
BMS-INTERFACE_1_SPI_MOSI: mcu1_secondary (IC1_1.32), U_15_bms-interface_interface/Secondary LTC6820 (R14_2.1), U_15_bms-interface_interface/Secondary LTC6820/U_0301_LTC6820_forward (IC250_3.1), U_15_bms-interface_interface/Secondary LTC6820/U_0301_LTC6820_reverse (IC250_4.1)
BMS-INTERFACE_1_SPI_SCK: mcu1_secondary (IC1_1.30), U_15_bms-interface_interface/Secondary LTC6820/U_0301_LTC6820_forward (IC250_3.3), U_15_bms-interface_interface/Secondary LTC6820/U_0301_LTC6820_reverse (IC250_4.3)
BOOT_0_MCU_0: mcu0_primary (IC10.166), ext_bootload_activation (R45.2 T6#1.3 X402.2)
~{CS_FW}_Primary LTC6820: U_15_bms-interface_interface/Primary LTC6820 (TP4_1#2.1 U4_1.8), U_15_bms-interface_interface/Primary LTC6820/U_0301_LTC6820_forward (IC250_1.4)
~{CS_FW}_Secondary LTC6820: U_15_bms-interface_interface/Secondary LTC6820 (TP4_2#2.1 U4_2.8), U_15_bms-interface_interface/Secondary LTC6820/U_0301_LTC6820_forward (IC250_3.4)
~{CS_RV}_Primary LTC6820: U_15_bms-interface_interface/Primary LTC6820 (TP3_1#2.1 U4_1.11), U_15_bms-interface_interface/Primary LTC6820/U_0301_LTC6820_reverse (IC250_2.4)
~{CS_RV}_Secondary LTC6820: U_15_bms-interface_interface/Secondary LTC6820 (TP3_2#2.1 U4_2.11), U_15_bms-interface_interface/Secondary LTC6820/U_0301_LTC6820_reverse (IC250_4.4)
CAN_0_RX: mcu0_primary (IC10.122), U_08_CAN0 (U38_2.3)
CAN_0_TX: mcu0_primary (IC10.123), U_08_CAN0 (U38_2.2)
CAN_1_RX: mcu0_primary (IC10.92), U_08_CAN1 (U38_1.3)
CAN_1_TX: mcu0_primary (IC10.93), U_08_CAN1 (U38_1.2)
COM_EXT_ISO_EN: supply_internal (U28.4), isolated_dcdc_3.3to3.3 (R108.1 U31.5)
CONTACTOR_0_CONTROL: mcu0_primary (IC10.131), contactor_control (IC12.5)
CONTACTOR_0_FEEDBACK: mcu0_primary (IC10.130), contactor_control (IC3#1.12)
CONTACTOR_1_CONTROL: mcu0_primary (IC10.132), contactor_control (IC12.4)
CONTACTOR_1_FEEDBACK: mcu0_primary (IC10.129), contactor_control (IC3#1.13)
CONTACTOR_2_CONTROL: mcu0_primary (IC10.133), contactor_control (IC12.3)
CONTACTOR_2_FEEDBACK: mcu0_primary (IC10.128), contactor_control (IC3#1.14)
CONTACTOR_3_CONTROL: mcu0_primary (IC10.134), contactor_control (IC12.2)
CONTACTOR_3_FEEDBACK: mcu0_primary (IC10.117), contactor_control (IC3#1.15)
CONTACTOR_6_CONTROL: mcu0_primary (IC10.139), connector_to_BMS_extension (JP2.17)
CONTACTOR_6_FEEDBACK: mcu0_primary (IC10.140), connector_to_BMS_extension (JP2.18)
CONTACTOR_7_CONTROL: mcu0_primary (IC10.144), connector_to_BMS_extension (JP2.15)
CONTACTOR_7_FEEDBACK: mcu0_primary (IC10.164), connector_to_BMS_extension (JP2.16)
CONTACTOR_8_CONTROL: mcu0_primary (IC10.44), connector_to_BMS_extension (JP1.9)
CONTACTOR_8_FEEDBACK: mcu0_primary (IC10.45), connector_to_BMS_extension (JP1.12)
CONTACTOR_SUPPLY_FAULT: mcu0_primary (IC10.116), contactor_control (IC3#1.11)
CONTACTOR_SUPPLY_FAULT_EXT: supply_external (U19.14), contactor_control (IC3#1.6 R91.1)
CONTACTOR_SUPPLY_SHDN: mcu0_primary (IC10.115), contactor_control (IC3#1.10 R97.2)
CONTACTOR_SUPPLY_SHDN_EXT: supply_external (U19.12), contactor_control (IC3#1.7)
DATA_STORAGE_SPI_EEPROM_CS: mcu0_primary (IC10.7), EEPROM (IC3#2.1)
DATA_STORAGE_SPI_MISO: mcu0_primary (IC10.155), EEPROM (IC3#2.2), memorycard (LSP9.1 R143.1 U22.7)
DATA_STORAGE_SPI_MOSI: mcu0_primary (IC10.157), EEPROM (IC3#2.5), memorycard (LSP7.1 R141.1 U22.3)
DATA_STORAGE_SPI_SCK: mcu0_primary (IC10.156), EEPROM (IC3#2.6), memorycard (LSP8.1 R142.2 U22.5)
DEBUG_LED_0_MCU_0: mcu0_primary (IC10.35), debug_LED (LED1.2)
DEBUG_LED_1_MCU_0: mcu0_primary (IC10.34), debug_LED (LED2.2)
EXT_0.FAULT: supply_internal (R51#1.1), dcdc_wide_3v3 (U7.7), supply_external (U13.22)
EXT_+3.3V_0_PG: supply_internal (R104.1 U28.3), dcdc_wide_3v3 (U7.6)
FMC_MCU_0_RAM_A0: mcu0_primary (IC10.16), SDRAM (IC4.23)
FMC_MCU_0_RAM_A1: mcu0_primary (IC10.17), SDRAM (IC4.24)
FMC_MCU_0_RAM_A2: mcu0_primary (IC10.18), SDRAM (IC4.25)
FMC_MCU_0_RAM_A3: mcu0_primary (IC10.19), SDRAM (IC4.26)
FMC_MCU_0_RAM_A4: mcu0_primary (IC10.20), SDRAM (IC4.29)
FMC_MCU_0_RAM_A5: mcu0_primary (IC10.21), SDRAM (IC4.30)
FMC_MCU_0_RAM_A6: mcu0_primary (IC10.60), SDRAM (IC4.31)
FMC_MCU_0_RAM_A7: mcu0_primary (IC10.63), SDRAM (IC4.32)
FMC_MCU_0_RAM_A8: mcu0_primary (IC10.64), SDRAM (IC4.33)
FMC_MCU_0_RAM_A9: mcu0_primary (IC10.65), SDRAM (IC4.34)
FMC_MCU_0_RAM_A10: mcu0_primary (IC10.66), SDRAM (IC4.22)
FMC_MCU_0_RAM_A11: mcu0_primary (IC10.67), SDRAM (IC4.35)
FMC_MCU_0_RAM_BA0: mcu0_primary (IC10.108), SDRAM (IC4.20)
FMC_MCU_0_RAM_BA1: mcu0_primary (IC10.109), SDRAM (IC4.21)
FMC_MCU_0_RAM_D0: mcu0_primary (IC10.104), SDRAM (IC4.2)
FMC_MCU_0_RAM_D1: mcu0_primary (IC10.105), SDRAM (IC4.4)
FMC_MCU_0_RAM_D2: mcu0_primary (IC10.142), SDRAM (IC4.5)
FMC_MCU_0_RAM_D3: mcu0_primary (IC10.143), SDRAM (IC4.7)
FMC_MCU_0_RAM_D4: mcu0_primary (IC10.68), SDRAM (IC4.13)
FMC_MCU_0_RAM_D5: mcu0_primary (IC10.69), SDRAM (IC4.11)
FMC_MCU_0_RAM_D6: mcu0_primary (IC10.70), SDRAM (IC4.10)
FMC_MCU_0_RAM_D7: mcu0_primary (IC10.73), SDRAM (IC4.8)
FMC_MCU_0_RAM_D8: mcu0_primary (IC10.74), SDRAM (IC4.42)
FMC_MCU_0_RAM_D9: mcu0_primary (IC10.75), SDRAM (IC4.44)
FMC_MCU_0_RAM_D10: mcu0_primary (IC10.76), SDRAM (IC4.45)
FMC_MCU_0_RAM_D11: mcu0_primary (IC10.77), SDRAM (IC4.47)
FMC_MCU_0_RAM_D12: mcu0_primary (IC10.78), SDRAM (IC4.48)
FMC_MCU_0_RAM_D13: mcu0_primary (IC10.96), SDRAM (IC4.50)
FMC_MCU_0_RAM_D14: mcu0_primary (IC10.97), SDRAM (IC4.51)
FMC_MCU_0_RAM_D15: mcu0_primary (IC10.98), SDRAM (IC4.53)
FMC_MCU_0_RAM_NBL0: mcu0_primary (IC10.169), SDRAM (IC4.15)
FMC_MCU_0_RAM_NBL1: mcu0_primary (IC10.170), SDRAM (IC4.39)
FMC_MCU_0_RAM_SDCKE1: mcu0_primary (IC10.84), SDRAM (IC4.37)
FMC_MCU_0_RAM_SDCLK: mcu0_primary (IC10.112), SDRAM (IC4.38)
FMC_MCU_0_RAM_SDNCAS: mcu0_primary (IC10.160), SDRAM (IC4.17)
FMC_MCU_0_RAM_SDNE1: mcu0_primary (IC10.83), SDRAM (IC4.19)
FMC_MCU_0_RAM_SDNRAS: mcu0_primary (IC10.59), SDRAM (IC4.18)
FMC_MCU_0_RAM_SDNWE: mcu0_primary (IC10.32), SDRAM (IC4.16)
GPIO.RTC_INT#: mcu0_primary (IC10.40), power (IC16.7 R70.1)
HSE_1_MCU_0: mcu0_primary (IC10.29), crystals (C112.2 Q13#1.1)
HSE_2_MCU_0: mcu0_primary (IC10.30), crystals (R112.1)
I2C3.SCL: mcu0_primary (IC10.119 R73.1), power (IC13.7 IC16.6)
I2C3.SDA: mcu0_primary (IC10.118 R72#1.1), power (IC13.6 IC16.5)
INTERLOCK_CONTROL_MCU_0: mcu0_primary (IC10.146), interlock_circuit (R85.2)
INTERLOCK_CONTROL_MCU_1: mcu1_secondary (IC1_1.85), interlock_circuit (R40.2)
INTERLOCK_FEEDBACK_MCU_0: mcu0_primary (IC10.147), interlock_circuit (R84.2 U21.3)
INTERLOCK_FEEDBACK_MCU_1: mcu1_secondary (IC1_1.86), interlock_circuit (R35#2.2 U8.3)
INTERLOCK_STATUS: interlock_circuit (D6#1.1 R52#1.2 SV3.1 X6.1), contactor_control (R43.2)
ISO_GPIO_MCU_0_IN_0: mcu0_primary (IC10.100), connector_to_BMS_extension (JP1.21)
ISO_GPIO_MCU_0_IN_1: mcu0_primary (IC10.101), connector_to_BMS_extension (JP1.24)
ISO_GPIO_MCU_0_IN_2: mcu0_primary (IC10.154), connector_to_BMS_extension (JP2.14)
ISO_GPIO_MCU_0_IN_3: mcu0_primary (IC10.173), connector_to_BMS_extension (JP2.9)
ISO_GPIO_MCU_0_OUT_0: mcu0_primary (IC10.152), connector_to_BMS_extension (JP2.10)
ISO_GPIO_MCU_0_OUT_1: mcu0_primary (IC10.153), connector_to_BMS_extension (JP2.13)
ISO_GPIO_MCU_0_OUT_2: mcu0_primary (IC10.174), connector_to_BMS_extension (JP2.12)
ISO_GPIO_MCU_0_OUT_3: mcu0_primary (IC10.175), connector_to_BMS_extension (JP2.11)
ISONOC_0_CONTROL: mcu0_primary (IC10.85), connector_to_BMS_extension (JP1.15)
ISONOC_1_CONTROL: mcu0_primary (IC10.86), connector_to_BMS_extension (JP1.18)
ISONOC_2_CONTROL: mcu0_primary (IC10.87), connector_to_BMS_extension (JP1.17)
ISONOC_3_CONTROL: mcu0_primary (IC10.88), connector_to_BMS_extension (JP1.20)
ISONOC_4_CONTROL: mcu0_primary (IC10.89), connector_to_BMS_extension (JP1.19)
ISONOC_5_CONTROL: mcu0_primary (IC10.99), connector_to_BMS_extension (JP1.22)
LSE_1_MCU_0: mcu0_primary (IC10.9), crystals (C99#1.2 Q12#1.2)
LSE_2_MCU_0: mcu0_primary (IC10.10), crystals (C102#1.1 Q12#1.1)
MCU_0_ISO_EN: supply_internal (R110.1 U28.6), U_03_supply1/MCU_0_ISO (U10_1.4)
MCU_0_NRESET: U_03_supply1/MCU_0_VCC (U8_1.4), mcu0_primary (6 pins)
MCU_1_ISO_EN: supply_internal (R109.1 U28.5), U_03_supply1/MCU_1_ISO (U10_2.4)
MCU_1_NRESET: U_03_supply1/MCU_1_VCC (U8_2.4), mcu1_secondary (6 pins)
MCU_TO_FPGA_INTERFACE_MCU_0_CS: FPGA_SPI_interface (SV2101.7), mcu0_primary (IC10.24)
MCU_TO_FPGA_INTERFACE_MCU_0_MISO: FPGA_SPI_interface (SV2101.4), mcu0_primary (IC10.26)
MCU_TO_FPGA_INTERFACE_MCU_0_MOSI: FPGA_SPI_interface (SV2101.8), mcu0_primary (IC10.27)
MCU_TO_FPGA_INTERFACE_MCU_0_SCK: FPGA_SPI_interface (SV2101.3), mcu0_primary (IC10.25)
MCU_TO_MCU_INTERFACE_MCU_0_CS: mcu0_primary (IC10.163), mcu0_to_mcu1_isolated_SPI (IC4_1.13)
MCU_TO_MCU_INTERFACE_MCU_0_MISO: mcu0_primary (IC10.94), mcu0_to_mcu1_isolated_SPI (IC4_1.11)
MCU_TO_MCU_INTERFACE_MCU_0_MOSI: mcu0_primary (IC10.95), mcu0_to_mcu1_isolated_SPI (IC4_1.15)
MCU_TO_MCU_INTERFACE_MCU_0_SCK: mcu0_primary (IC10.145), mcu0_to_mcu1_isolated_SPI (IC4_1.14)
MCU_TO_MCU_INTERFACE_MCU_1_CS: mcu0_to_mcu1_isolated_SPI (IC4_1.4), mcu1_secondary (IC1_1.51)
MCU_TO_MCU_INTERFACE_MCU_1_MISO: mcu0_to_mcu1_isolated_SPI (IC4_1.6), mcu1_secondary (IC1_1.53)
MCU_TO_MCU_INTERFACE_MCU_1_MOSI: mcu0_to_mcu1_isolated_SPI (IC4_1.2), mcu1_secondary (IC1_1.54)
MCU_TO_MCU_INTERFACE_MCU_1_SCK: mcu0_to_mcu1_isolated_SPI (IC4_1.3), mcu1_secondary (IC1_1.84)
OUT_N: U_15_bms-interface_interface/Primary LTC6820/U_0301_LTC6820_forward (IC250_1.9 R400_1.1), bms-slave-magnetics (TR1.11)
OUT_N: U_15_bms-interface_interface/Primary LTC6820/U_0301_LTC6820_reverse (IC250_2.9 R400_2.1), bms-slave-magnetics (TR2.11)
OUT_N: bms-slave-magnetics (TR1.16), U_15_bms-interface_interface/Secondary LTC6820/U_0301_LTC6820_forward (IC250_3.9 R400_3.1)
OUT_N: bms-slave-magnetics (TR2.16), U_15_bms-interface_interface/Secondary LTC6820/U_0301_LTC6820_reverse (IC250_4.9 R400_4.1)
OUT_P: U_15_bms-interface_interface/Primary LTC6820/U_0301_LTC6820_forward (IC250_1.10 R400_1.2), bms-slave-magnetics (TR1.9)
OUT_P: U_15_bms-interface_interface/Primary LTC6820/U_0301_LTC6820_reverse (IC250_2.10 R400_2.2), bms-slave-magnetics (TR2.9)
OUT_P: bms-slave-magnetics (TR1.14), U_15_bms-interface_interface/Secondary LTC6820/U_0301_LTC6820_forward (IC250_3.10 R400_3.2)
OUT_P: bms-slave-magnetics (TR2.14), U_15_bms-interface_interface/Secondary LTC6820/U_0301_LTC6820_reverse (IC250_4.10 R400_4.2)
RS485_DE: mcu0_primary (IC10.107), isolated_rs485 (IC1303.5 LSP1301.1)
RS485_MCU_0_NRE: mcu0_primary (IC10.106), isolated_rs485 (IC1303.4 LSP1304.1)
RS485_MCU_0_RX: mcu0_primary (IC10.121), isolated_rs485 (IC1303.3 LSP1303.1)
RS485_MCU_0_TX: mcu0_primary (IC10.120), isolated_rs485 (IC1303.6 LSP1302.1)
RS485_YZ_N: hierarchy (P2.3), isolated_rs485 (R92.1 U2.1)
RS485_YZ_P: hierarchy (P2.4), isolated_rs485 (R55.1 U2.2)

## Assembly variants
default: not fitted D1001 D1002 D1003 D1004 D1005 D1006 SV501 X902